# EAGLE design main_board (EAGLE 9.3.2)
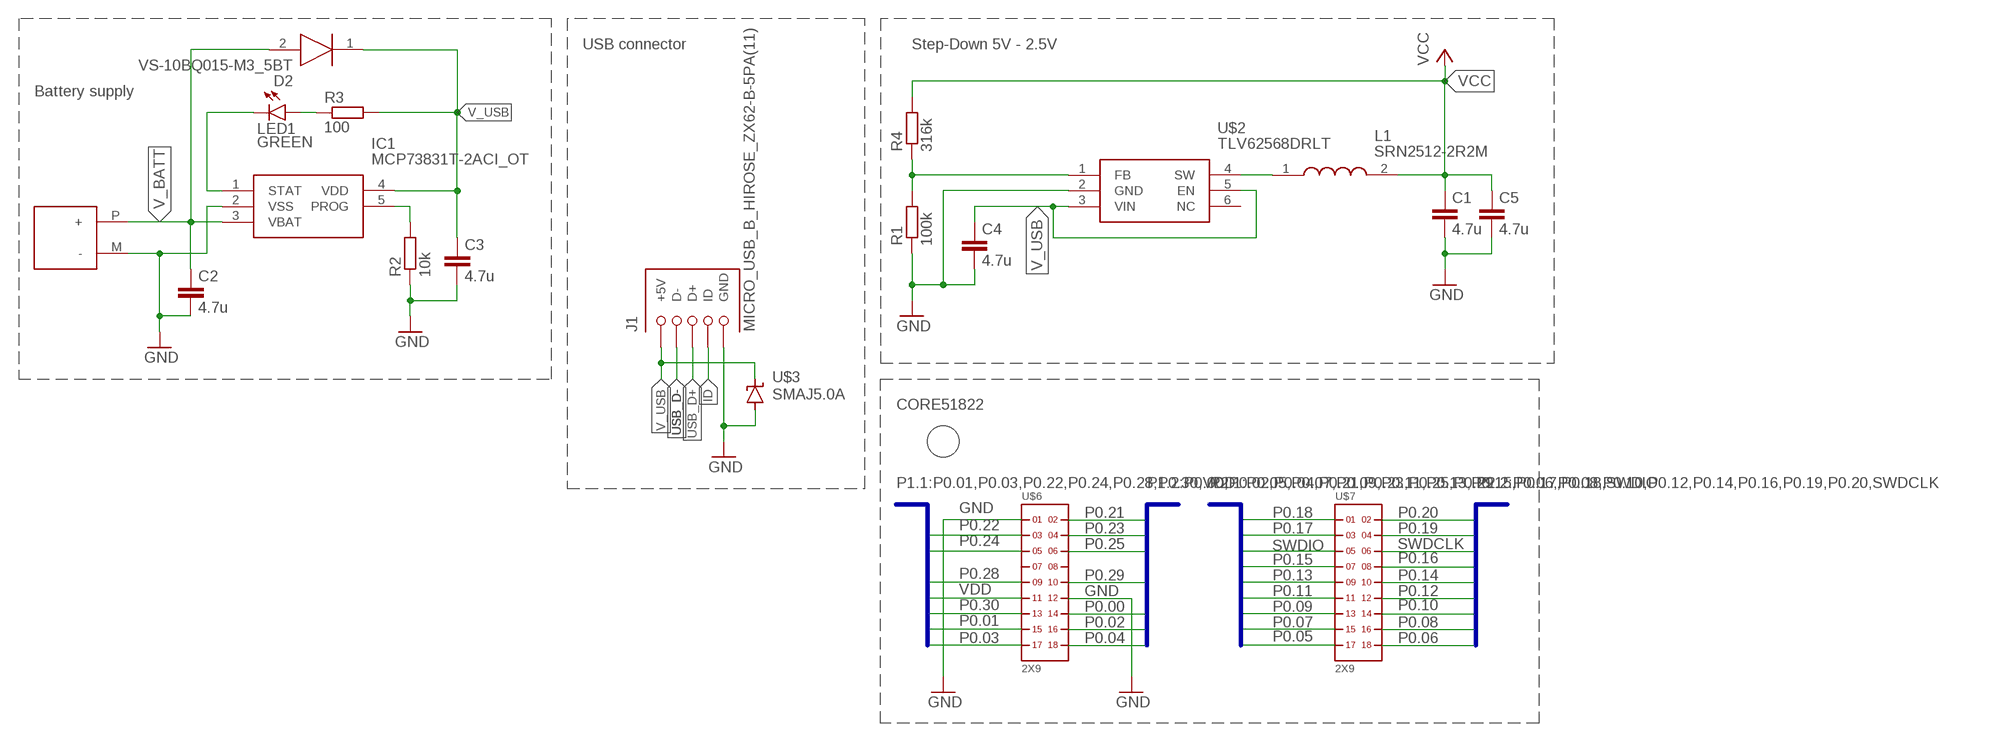
[diagram p0: schematic, sheet 1]

## Parts
C1  4.7u  C-EUC1206  [C1206]
C2  4.7u  C-EUC1206  [C1206]
C3  4.7u  C-EUC1206  [C1206]
C4  4.7u  C-EUC1206  [C1206]
C5  4.7u  C-EUC1206  [C1206]
D2  VS-10BQ015-M3_5BT  [DIOM5436X244N]
IC1  MCP73831T-2ACI_OT  [SOT95P270X145-5N]
J1  MICRO_USB_B_HIROSE_ZX62-B-5PA(11)  [USB_MICRO_B-HIROSE-ZX62-B-5PA(11)]
L1  SRN2512-2R2M  [INDPM2622X120N]
LED1  GREEN  LEDCHIPLED_1206  [CHIPLED_1206]
R1  100k  R-EU_R1206  [R1206]
R2  10k  R-EU_R1206  [R1206]
R3  100  R-EU_R1206  [R1206]
R4  316k  R-EU_R1206  [R1206]
U$1  BAT_FLAT_PAD  [BATTERY_FLAT_PAD]
U$2  TLV62568DRLT  [SOT563]
U$3  SMAJ5.0A  [DO-214AC]
U$6  2X9  [2X9]
U$7  2X9  [2X9]

## Nets
GND: C1.2 C2.2 C3.2 C4.2 C5.2 IC1.2(VSS) J1.5(GND) R1.1 R2.1 U$1.M(-) U$2.2(GND) U$3.A U$6.1 U$6.12
ID: J1.4(ID)
N$1 [Wide]: LED1.A R3.1
N$2 [Wide]: IC1.1(STAT) LED1.C
N$3 [Wide]: IC1.5(PROG) R2.2
N$6 [Vdd]: L1.1 U$2.4(SW)
N$8: R1.2 R4.1 U$2.1(FB)
P0.00: U$6.14
P0.01: U$6.15
P0.02: U$6.16
P0.03: U$6.17
P0.04: U$6.18
P0.05: U$7.17
P0.06: U$7.18
P0.07: U$7.15
P0.08: U$7.16
P0.09: U$7.13
P0.10: U$7.14
P0.11: U$7.11
P0.12: U$7.12
P0.13: U$7.9
P0.14: U$7.10
P0.15: U$7.7
P0.16: U$7.8
P0.17: U$7.3
P0.18: U$7.1
P0.19: U$7.4
P0.20: U$7.2
P0.21: U$6.2
P0.22: U$6.3
P0.23: U$6.4
P0.24: U$6.5
P0.25: U$6.6
P0.28: U$6.9
P0.29: U$6.10
P0.30: U$6.13
SWDCLK: U$7.6
SWDIO: U$7.5
USB_D+: J1.3(D+)
USB_D-: J1.2(D-)
V_BATT: C2.1 D2.2(A) IC1.3(VBAT) U$1.P(+)
V_USB [Vdd]: C3.1 C4.1 D2.1(K) IC1.4(VDD) J1.1(+5V) R3.2 U$2.3(VIN) U$2.5(EN) U$3.C
VCC [Vdd]: C1.1 C5.1 L1.2 R4.2
VDD [Wide]: U$6.11
Unconnected: U$2.6(NC) U$6.7 U$6.8

## Buses
P1.1:P0.01,P0.03,P0.22,P0.24,P0.28,P0.30,VDD
P1.2:P0.00,P0.02,P0.04,P0.21,P0.23,P0.25,P0.29
P2.1:P0.05,P0.07,P0.09,P0.11,P0.13,P0.15,P0.17,P0.18,SWDIO
P2.2:P0.06,P0.08,P0.10,P0.12,P0.14,P0.16,P0.19,P0.20,SWDCLK

## Notes on the sheet
- USB connector | Step-Down 5V - 2.5V
- Battery supply
- CORE51822

## Library data of the parts
C1-C5 = resistor:C-EU: CAPACITOR, European symbol
D2 = SamacSys_Parts:VS-10BQ015-M3_5BT: VS-10BQ015-M3/5BT Vishay SMT Schottky Diode, 15V 1A, 2-Pin DO-214AA (SMB) Source: Datasheet <https://componentsearchengine.com/Datasheets/1/VS-10BQ015-M3_5BT.pdf>; DESCRIPTION: VS-10BQ015-M3/5BT Vishay SMT Schottky Diode, 15V 1A, 2-Pin DO-214AA (SMB); HEIGHT: 2.44mm; MANUFACTURER_NAME: Vishay; MANUFACTURER_PART_NUMBER: VS-10BQ015-M3/5BT; MOUSER_PART_NUMBER: 78-VS-10BQ015-M35BT; MOUSER_PRICE-STOCK: https://www.mouser.com/Search/Refine.aspx?Keyword=78-VS-10BQ015-M35BT
IC1 = SamacSys_Parts:MCP73831T-2ACI_OT: Li-Ion Charge Controller 4.2V SOT23-5 Source: Datasheet <https://componentsearchengine.com/Datasheets/1/MCP73831T-2ACI_OT.pdf>; DESCRIPTION: Li-Ion Charge Controller 4.2V SOT23-5; HEIGHT: 1.45mm; MANUFACTURER_NAME: Microchip; MANUFACTURER_PART_NUMBER: MCP73831T-2ACI/OT; MOUSER_PART_NUMBER: 579-MCP73831T-2ACIOT; MOUSER_PRICE-STOCK: https://www.mouser.com/Search/Refine.aspx?Keyword=579-MCP73831T-2ACIOT
J1 = connector:MICRO_USB_B_HIROSE_ZX62-B-5PA(11): Connector Receptacle USB - micro B 2.0 5 Position Surface Mount, Right Angle, Horizontal Bottom Mount; DIGIKEY: H11634CT-ND; MOUSER: 798-ZX62-B-5PA11; NEWARK: 86P8793
L1 = SamacSys_Parts:SRN2512-2R2M: Bourns SRN2512 Series Shielded Wire-wound SMD Inductor with a Ferrite Core, 2.2 uH +/-20% 2.3A Idc Source: Datasheet <https://componentsearchengine.com/Datasheets/1/SRN2512-2R2M.pdf>; DESCRIPTION: Bourns SRN2512 Series Shielded Wire-wound SMD Inductor with a Ferrite Core, 2.2 uH +/-20% 2.3A Idc; HEIGHT: 1.2mm; MANUFACTURER_NAME: Bourns; MANUFACTURER_PART_NUMBER: SRN2512-2R2M; MOUSER_PART_NUMBER: 652-SRN2512-2R2M; MOUSER_PRICE-STOCK: https://www.mouser.com/Search/Refine.aspx?Keyword=652-SRN2512-2R2M
LED1 = led:LED: LED OSRAM: - CHIPLED LG R971, LG N971, LY N971, LG Q971, LY Q971, LO R971, LY R971 LH N974, LH R974 LS Q976, LO Q976, LY Q976 LO Q996 - Hyper CHIPLED LW Q18S LB Q993, LB Q99A, LB R99A - SideLED LS A670, LO A670, LY A670, LG A670, LP A670 LB A673, LV A673, LT A673, LW A673 LH A674 LY A675 LS A676, LA A676, LO A676, LY A676, LW A676 LS A679, LY A679, LG A679 - Hyper Micro SIDELED® LS Y876, LA Y876, LO Y876, LY Y876 LT Y87S - SmartLED LW L88C, LW L88S LB L89C, LB L89S, LG L890 LS L89K, LO L89K, LY L89K LS L896, LA L896, LO L896, LY L896 - TOPLED LS T670, LO T670, LY T670, LG T670, LP T670 LSG T670, LSP T670, LSY T670, LOP T670, LYG T670 LG T671, LOG T671, LSG T671 LB T673, LV T673, LT T673, LW T673 LH T674 LS T676, LA T676, LO T676, LY T676, LB T676, LH T676, LSB T676, LW T676 LB T67C, LV T67C, LT T67C, LS T67K, LO T67K, LY T67K, LW E67C LS E67B, LA E67B, LO E67B, LY E67B, LB E67C, LV E67C, LT E67C LW T67C LS T679, LY T679, LG T679 LS T770, LO T770, LY T770, LG T770, LP T770 LB T773, LV T773, LT T773, LW T773 LH T774 LS E675, LA E675, LY E675, LS T675 LS T776, LA T776, LO T776, LY T776, LB T776 LHGB T686 LT T68C, LB T68C - Hyper Mini TOPLED® LB M676 - Mini TOPLED Santana® LG M470 LS M47K, LO M47K, LY M47K Source: http://www.osram.convergy.de LUXEON: - LUMILED® LXK2-PW12-R00, LXK2-PW12-S00, LXK2-PW14-U00, LXK2-PW14-V00 LXK2-PM12-R00, LXK2-PM12-S00, LXK2-PM14-U00 LXK2-PE12-Q00, LXK2-PE12-R00, LXK2-PE12-S00, LXK2-PE14-T00, LXK2-PE14-U00 LXK2-PB12-K00, LXK2-PB12-L00, LXK2-PB12-M00, LXK2-PB14-N00, LXK2-PB14-P00, LXK2-PB14-Q00 LXK2-PR12-L00, LXK2-PR12-M00, LXK2-PR14-Q00, LXK2-PR14-R00 LXK2-PD12-Q00, LXK2-PD12-R00, LXK2-PD12-S00 LXK2-PH12-R00, LXK2-PH12-S00 LXK2-PL12-P00, LXK2-PL12-Q00, LXK2-PL12-R00 Source: www.luxeon.com KINGBRIGHT: KA-3528ASYC Source: www.kingbright.com
R1-R4 = resistor:R-EU_: RESISTOR, European symbol
U$1 = connector:BAT_FLAT_PAD
U$2 = SamacSys_Parts:TLV62568DRLT
U$3 = SamacSys_Parts:SMAJ5.0A
U$6 U$7 = headers(2mm):2X9

## Net classes
0 default: width 0.203 mm, drill 0.4 mm, clearance 0.203 mm
1 Wide: width 0.61 mm, clearance 0.254 mm
2 Vdd: width 0.305 mm, clearance 0.203 mm

## Board
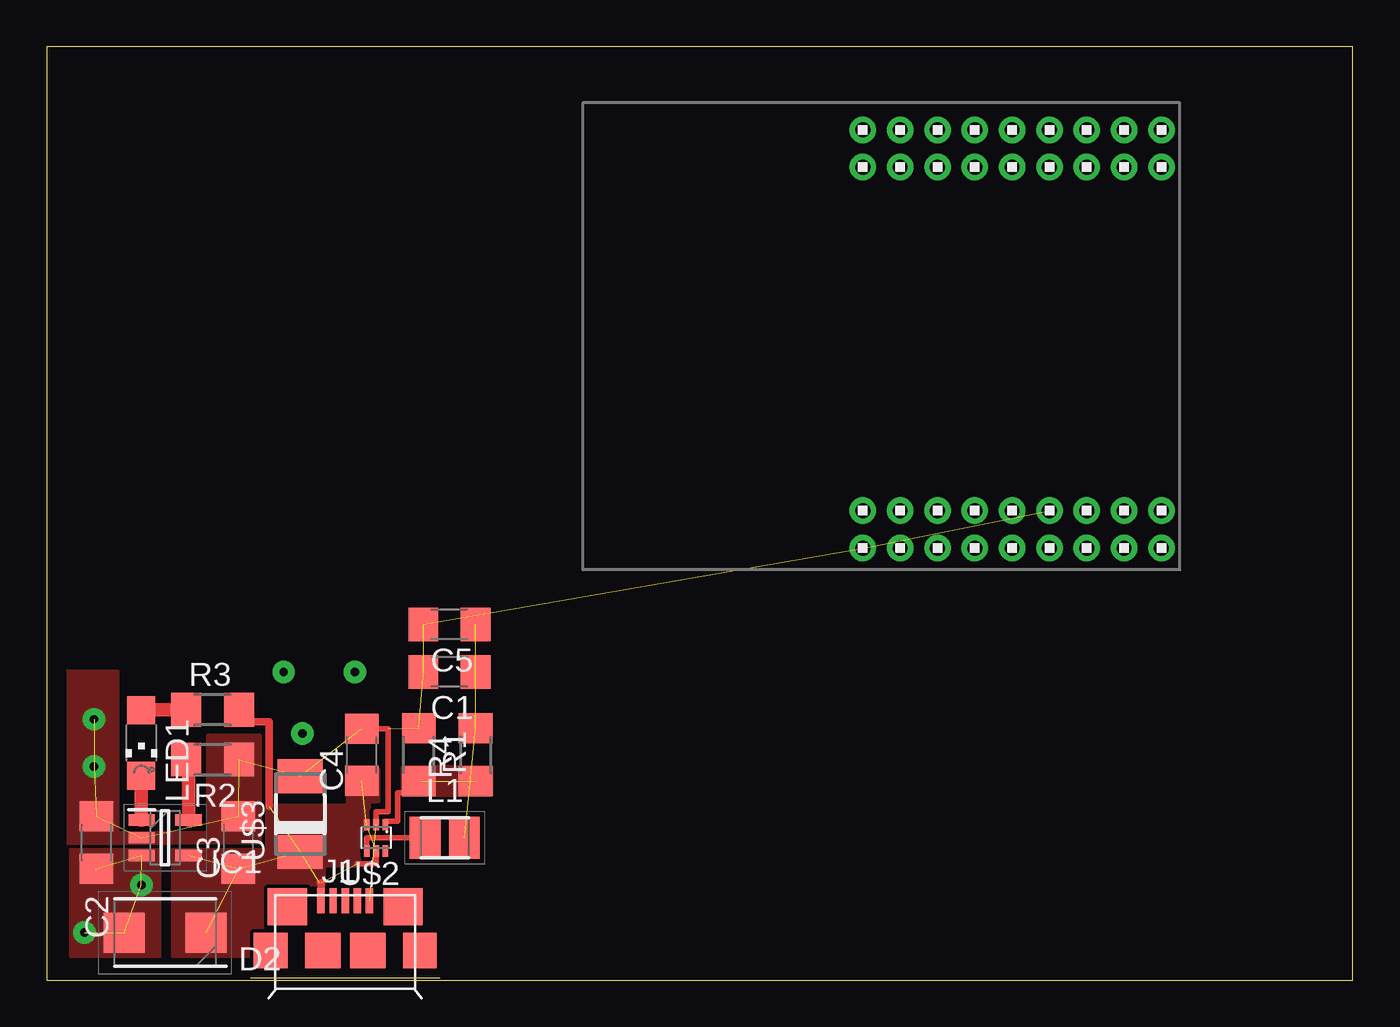
[diagram p1: board, top side]
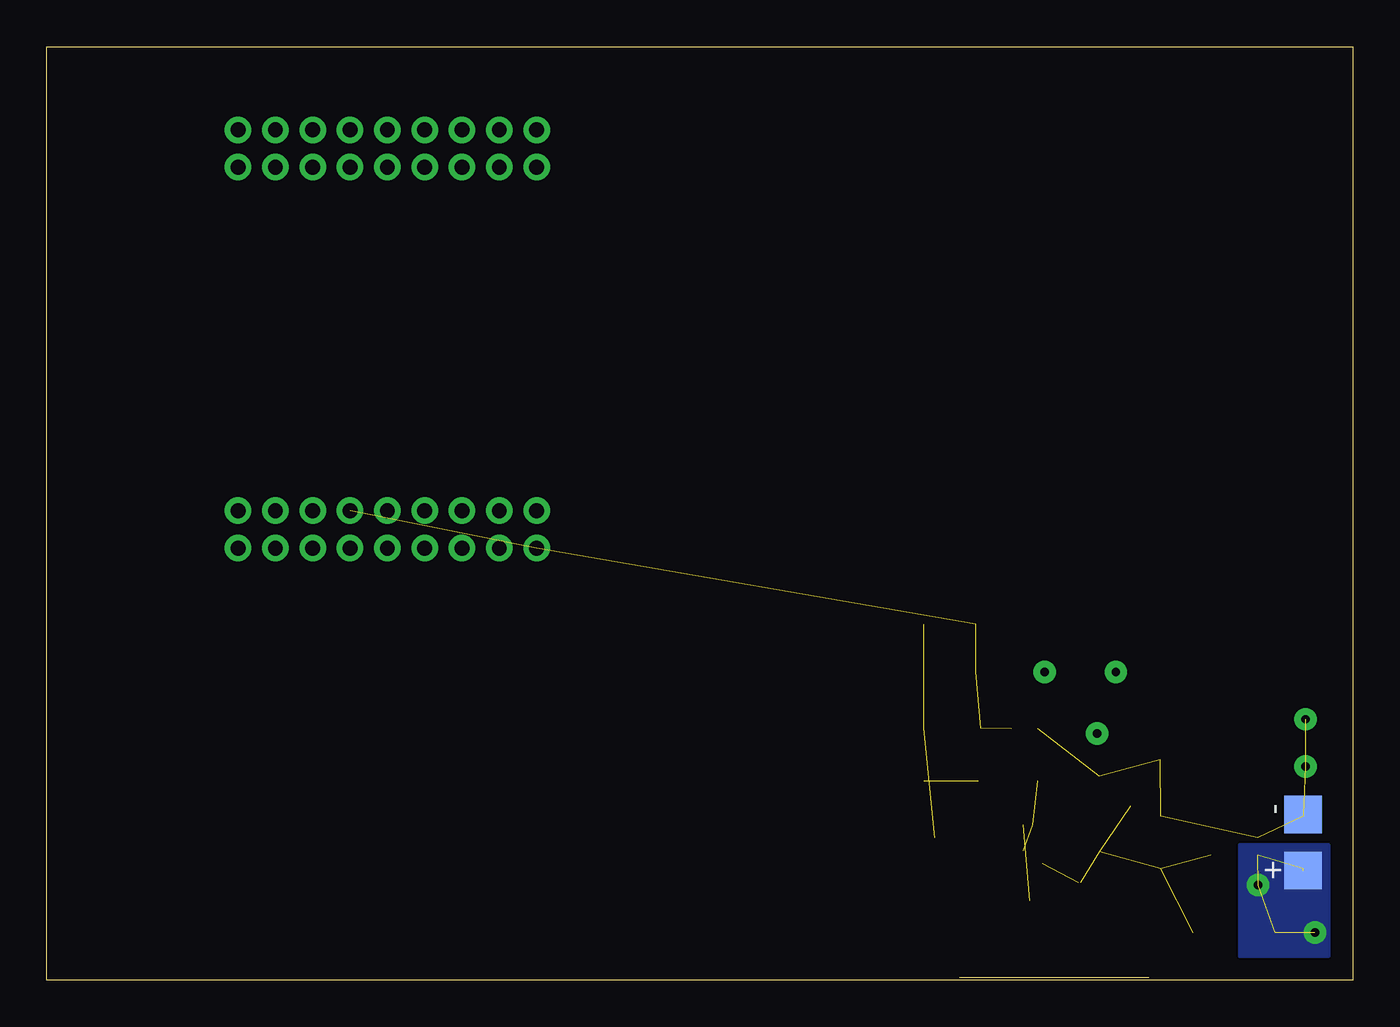
[diagram p2: board, bottom side, seen from below]

Size 70 x 50 mm. Coordinates in mm from the lower left corner, seen from the top.
Outline: 0,0 70,0 70,50 0,50 0,0
Copper layers (1*16): Top 0.035mm / dielectric 1.5mm / Bottom 0.035mm
Design rules "default *": minimum track width 8mil, minimum drill 0.35mm, track to track 8mil, track to pad 8mil, pad to pad 8mil, via to via 8mil, smd to smd 6mil, copper to edge 40mil, drill to drill 8mil, minimum pad ring 10mil, minimum via ring 8mil, stop-mask expansion 4mil, vias tented up to drill 0mil, thermal gap 10mil

### Footprints (pad centres in the part's own frame; a part is rotated, then mirrored left to right if it is on the bottom)
C1206 = smd 1.6 x 1.8: 1 -1.4,0; 2 1.4,0
DIOM5436X244N = smd 2.2 x 2.15: 1 -2.2,0; 2 2.2,0
SOT95P270X145-5N = smd 1.4 x 0.6: 1 -1.25,0.95; 2 -1.25,0; 3 -1.25,-0.95; 4 1.25,-0.95; 5 1.25,0.95
USB_MICRO_B-HIROSE-ZX62-B-5PA(11) = smd 0.4 x 1.35: 1 -1.3,4.125; 2 -0.65,4.125; 3 0,4.125; 4 0.65,4.125; 5 1.3,4.125 | smd 2.1 x 2: P$1 3.1,3.8; P$2 -3.1,3.8 | smd 1.8 x 1.9: P$3 -4,1.45; P$6 4,1.45 | smd 1.9 x 1.9: P$4 -1.2,1.45; P$5 1.2,1.45
INDPM2622X120N = smd 1.65 x 2.25: 1 -1.05,0; 2 1.05,0
CHIPLED_1206 = smd 1.5 x 1.5: A 0,-1.75; C 0,1.75
R1206 = smd 1.6 x 1.803: 1 -1.422,0; 2 1.422,0
BATTERY_FLAT_PAD = smd 2 x 2: M 1.5,0; P -1.5,0
SOT563 = smd 0.305 x 0.61: 1 -0.5,-0.7; 2 0,-0.7; 3 0.5,-0.7; 4 0.5,0.7; 5 0,0.7; 6 -0.5,0.7
DO-214AC = smd 1.8 x 2.4: A 2.025,0; C -2.025,0
2X9 = drill 0.8 pad 1.422: 1 -8,-1; 2 -8,1; 3 -6,-1; 4 -6,1; 5 -4,-1; 6 -4,1; 7 -2,-1; 8 -2,1; 9 0,-1; 10 0,1; 11 2,-1; 12 2,1; 13 4,-1; 14 4,1; 15 6,-1; 16 6,1; 17 8,-1; 18 8,1

### Placement (x,y rotation side)
C1  21.59,16.51 180 top
C2  2.67,7.37 90 top
C3  10.29,7.37 90 top
C4  16.89,12.06 90 top
C5  21.59,19.05 180 top
D2  6.35,2.54 180 top
IC1  6.35,7.62 0 top
J1  16,0.13 0 top
L1  21.34,7.62 0 top
LED1  5.08,12.7 180 top
R1  19.94,12.06 270 top
R2  8.89,11.81 180 top
R3  8.89,14.48 0 top
R4  22.99,12.06 90 top
U$1  2.67,7.37 90 bottom
U$2  17.65,7.62 180 top
U$3  13.59,8.89 90 top
U$6  51.74,24.14 0 top
U$7  51.74,44.54 0 top

### Tracks (layer width: path | path; a pad name or v marks a point on that pad's centre or on a via)
GND  (via drill 0.45 pad 1.2)  (14 unrouted)
  Top 0.305: U$2.2 17.65,9.02 18.29,9.02 18.29,13.46 C4.2
  other vias: 2.54,13.97 2.54,11.43
  pour Top (no thermals): 0.64,16.51 0.64,7.37 6.35,7.37 6.35,7.87 3.81,7.87 3.81,16.51
  pour Top (rank 2, no thermals): 6.35,7.37 11.43,7.37 11.43,13.08 8.64,13.08 8.64,7.87 6.35,7.87
N$1
  Top 0.711: LED1.A arc-90 5.11,14.48 R3.1
N$2
  Top 0.711: LED1.C 5.08,8.57 IC1.1
N$3
  Top 0.711: R2.2 arc90 7.6,11.68 IC1.5
N$4  (via drill 0.45 pad 1.2)
  other vias: 16.51,16.51
N$5  (via drill 0.45 pad 1.2)
  other vias: 12.7,16.51
N$6
  Top 0.305: U$2.4 17.15,7.62 19.05,7.62 19.3,7.62 L1.1
N$7  (via drill 0.45 pad 1.2)
  other vias: 13.72,13.21
N$8  (1 unrouted)
  Top 0.305: U$2.1 18.15,8.51 18.8,8.51 18.8,10.03 19.3,10.03 R1.2 20.07,10.64
  pour Top (no thermals): 19.05,11.43 19.05,9.91 23.88,9.91 23.88,11.43
V_BATT  (via drill 0.45 pad 1.2)  (5 unrouted)
  other vias: 2.03,2.54 5.08,5.08
  pour Top (no thermals): 1.27,6.99 1.27,1.27 6.1,1.27 6.1,6.99
  pour Bottom (no thermals): 1.27,7.24 6.1,7.24 6.1,1.27 1.27,1.27
V_USB  (8 unrouted)
  Top 0.305: 14.7,5.21 14.61,5.21 | U$2.5 17.65,6.22 16.64,6.22
  Top 0.406: R3.2 10.31,13.84 11.92,13.84 11.92,9.32 | J1.1 14.7,5.21
  pour Top (no thermals): 6.73,6.99 6.73,1.27 13.21,1.27 13.21,6.99
  pour Top (no thermals): 11.81,5.08 11.81,9.4 16.13,9.4 16.13,11.3 17.78,11.3 17.78,9.53 17.27,9.53 17.27,8 16.76,8 16.76,6.1 14.86,6.1 14.86,5.08
VCC  (3 unrouted)